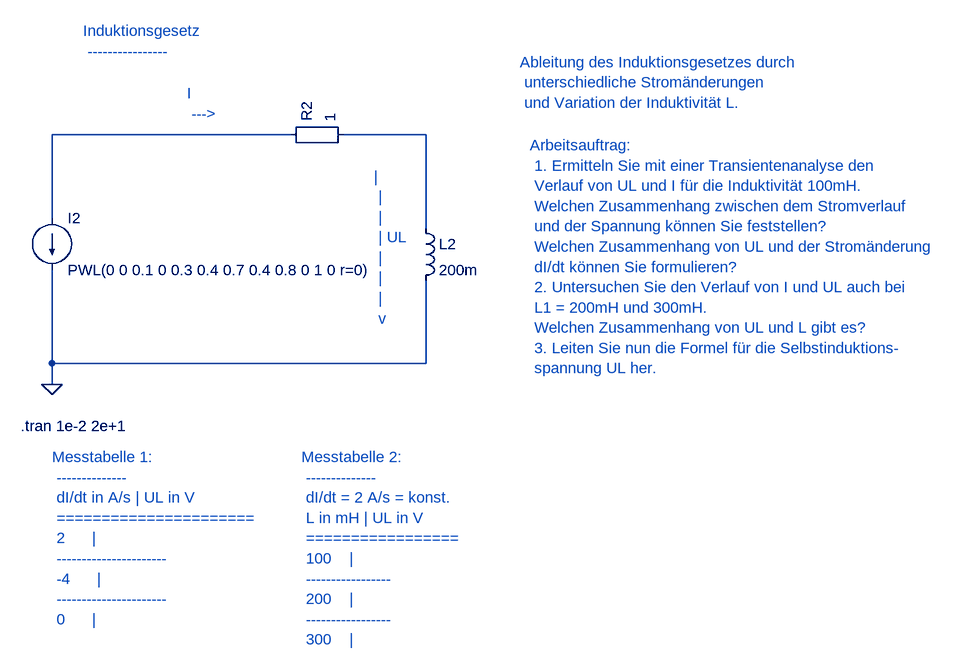
[diagram p0: schematic 1_2_1_Induktion_Energie_der_Spule.asc]
1_2_1_Induktion_Energie_der_Spule.asc, the LTspice schematic file:
Version 4
SHEET 1 880 680
WIRE 112 416 112 432
WIRE 688 432 688 560
WIRE 688 560 112 560
WIRE 112 336 112 208
WIRE 112 208 480 208
WIRE 112 560 112 592
WIRE 112 432 112 560
WIRE 560 208 688 208
WIRE 688 208 688 352
FLAG 112 592 0
SYMBOL Misc\EuropeanResistor 464 224 R270
SYMATTR InstName R2
SYMATTR Value 1
SYMBOL ind 672 336 R0
SYMATTR InstName L2
SYMATTR Value 200m
SYMBOL current 112 336 R0
SYMATTR InstName I2
SYMATTR Value PWL(0 0 0.1 0 0.3 0.4 0.7 0.4 0.8 0 1 0 r=0)
TEXT 64 656 Left 2 !.tran 1e-2 2e+1
TEXT 832 96 Left 2 ;Ableitung des Induktionsgesetzes durch \n unterschiedliche Stromänderungen \n und Variation der Induktivität L.
TEXT 160 48 Left 2 ;Induktionsgesetz \n ----------------
TEXT 848 224 Left 2 ;Arbeitsauftrag: \n 1. Ermitteln Sie mit einer Transientenanalyse den \n Verlauf von UL und I für die Induktivität 100mH. \n Welchen Zusammenhang zwischen dem Stromverlauf \n und der Spannung können Sie feststellen? \n Welchen Zusammenhang von UL und der Stromänderung \n dI/dt können Sie formulieren? \n 2. Untersuchen Sie den Verlauf von I und UL auch bei \n L1 = 200mH und 300mH. \n Welchen Zusammenhang von UL und L gibt es? \n 3. Leiten Sie nun die Formel für die Selbstinduktions- \n spannung UL her.
TEXT 320 144 Left 2 ;I \n --->
TEXT 608 272 Left 2 ;| \n | \n | \n | UL \n | \n | \n | \n v
TEXT 112 704 Left 2 ;Messtabelle 1: \n -------------- \n dI/dt in A/s | UL in V \n ====================== \n 2      | \n ---------------------- \n -4      | \n ---------------------- \n 0      |
TEXT 496 704 Left 2 ;Messtabelle 2: \n -------------- \n dI/dt = 2 A/s = konst. \n L in mH | UL in V \n ================= \n 100    | \n ----------------- \n 200    | \n ----------------- \n 300    |

The netlist it stands for:
* 1_2_1_Induktion_Energie_der_Spule.asc
R2 N001 N002 1
L2 N002 0 200m
I2 N001 0 PWL(0 0 0.1 0 0.3 0.4 0.7 0.4 0.8 0 1 0 r=0)
.tran 1e-2 2e+1
* Ableitung des Induktionsgesetzes durch
*  unterschiedliche Stromänderungen
*  und Variation der Induktivität L.
* Induktionsgesetz
*  ----------------
* Arbeitsauftrag:
*  1. Ermitteln Sie mit einer Transientenanalyse den
*  Verlauf von UL und I für die Induktivität 100mH.
*  Welchen Zusammenhang zwischen dem Stromverlauf
*  und der Spannung können Sie feststellen?
*  Welchen Zusammenhang von UL und der Stromänderung
*  dI/dt können Sie formulieren?
*  2. Untersuchen Sie den Verlauf von I und UL auch bei
*  L1 = 200mH und 300mH.
*  Welchen Zusammenhang von UL und L gibt es?
*  3. Leiten Sie nun die Formel für die Selbstinduktions-
*  spannung UL her.
* I
*  --->
* |
*  |
*  |
*  | UL
*  |
*  |
*  |
*  v
* Messtabelle 1:
*  --------------
*  dI/dt in A/s | UL in V
*  ======================
*  2      |
*  ----------------------
*  -4      |
*  ----------------------
*  0      |
* Messtabelle 2:
*  --------------
*  dI/dt = 2 A/s = konst.
*  L in mH | UL in V
*  =================
*  100    |
*  -----------------
*  200    |
*  -----------------
*  300    |
.backanno
.end